# Altium project LimeSDR-USB_1v4.PrjPcb (part 3 of 8)

## Sheet 12_USB3_0_device.SchDoc: USB3.0 device
size A3; Organization: Lime Microsystems; Address1: Surrey Tech Centre; Address2: Guildford GU2 7YG; Address3: Surray; Address4: United Kingdom; Revision: v1.4; SheetNumber: 12; SheetTotal: 15
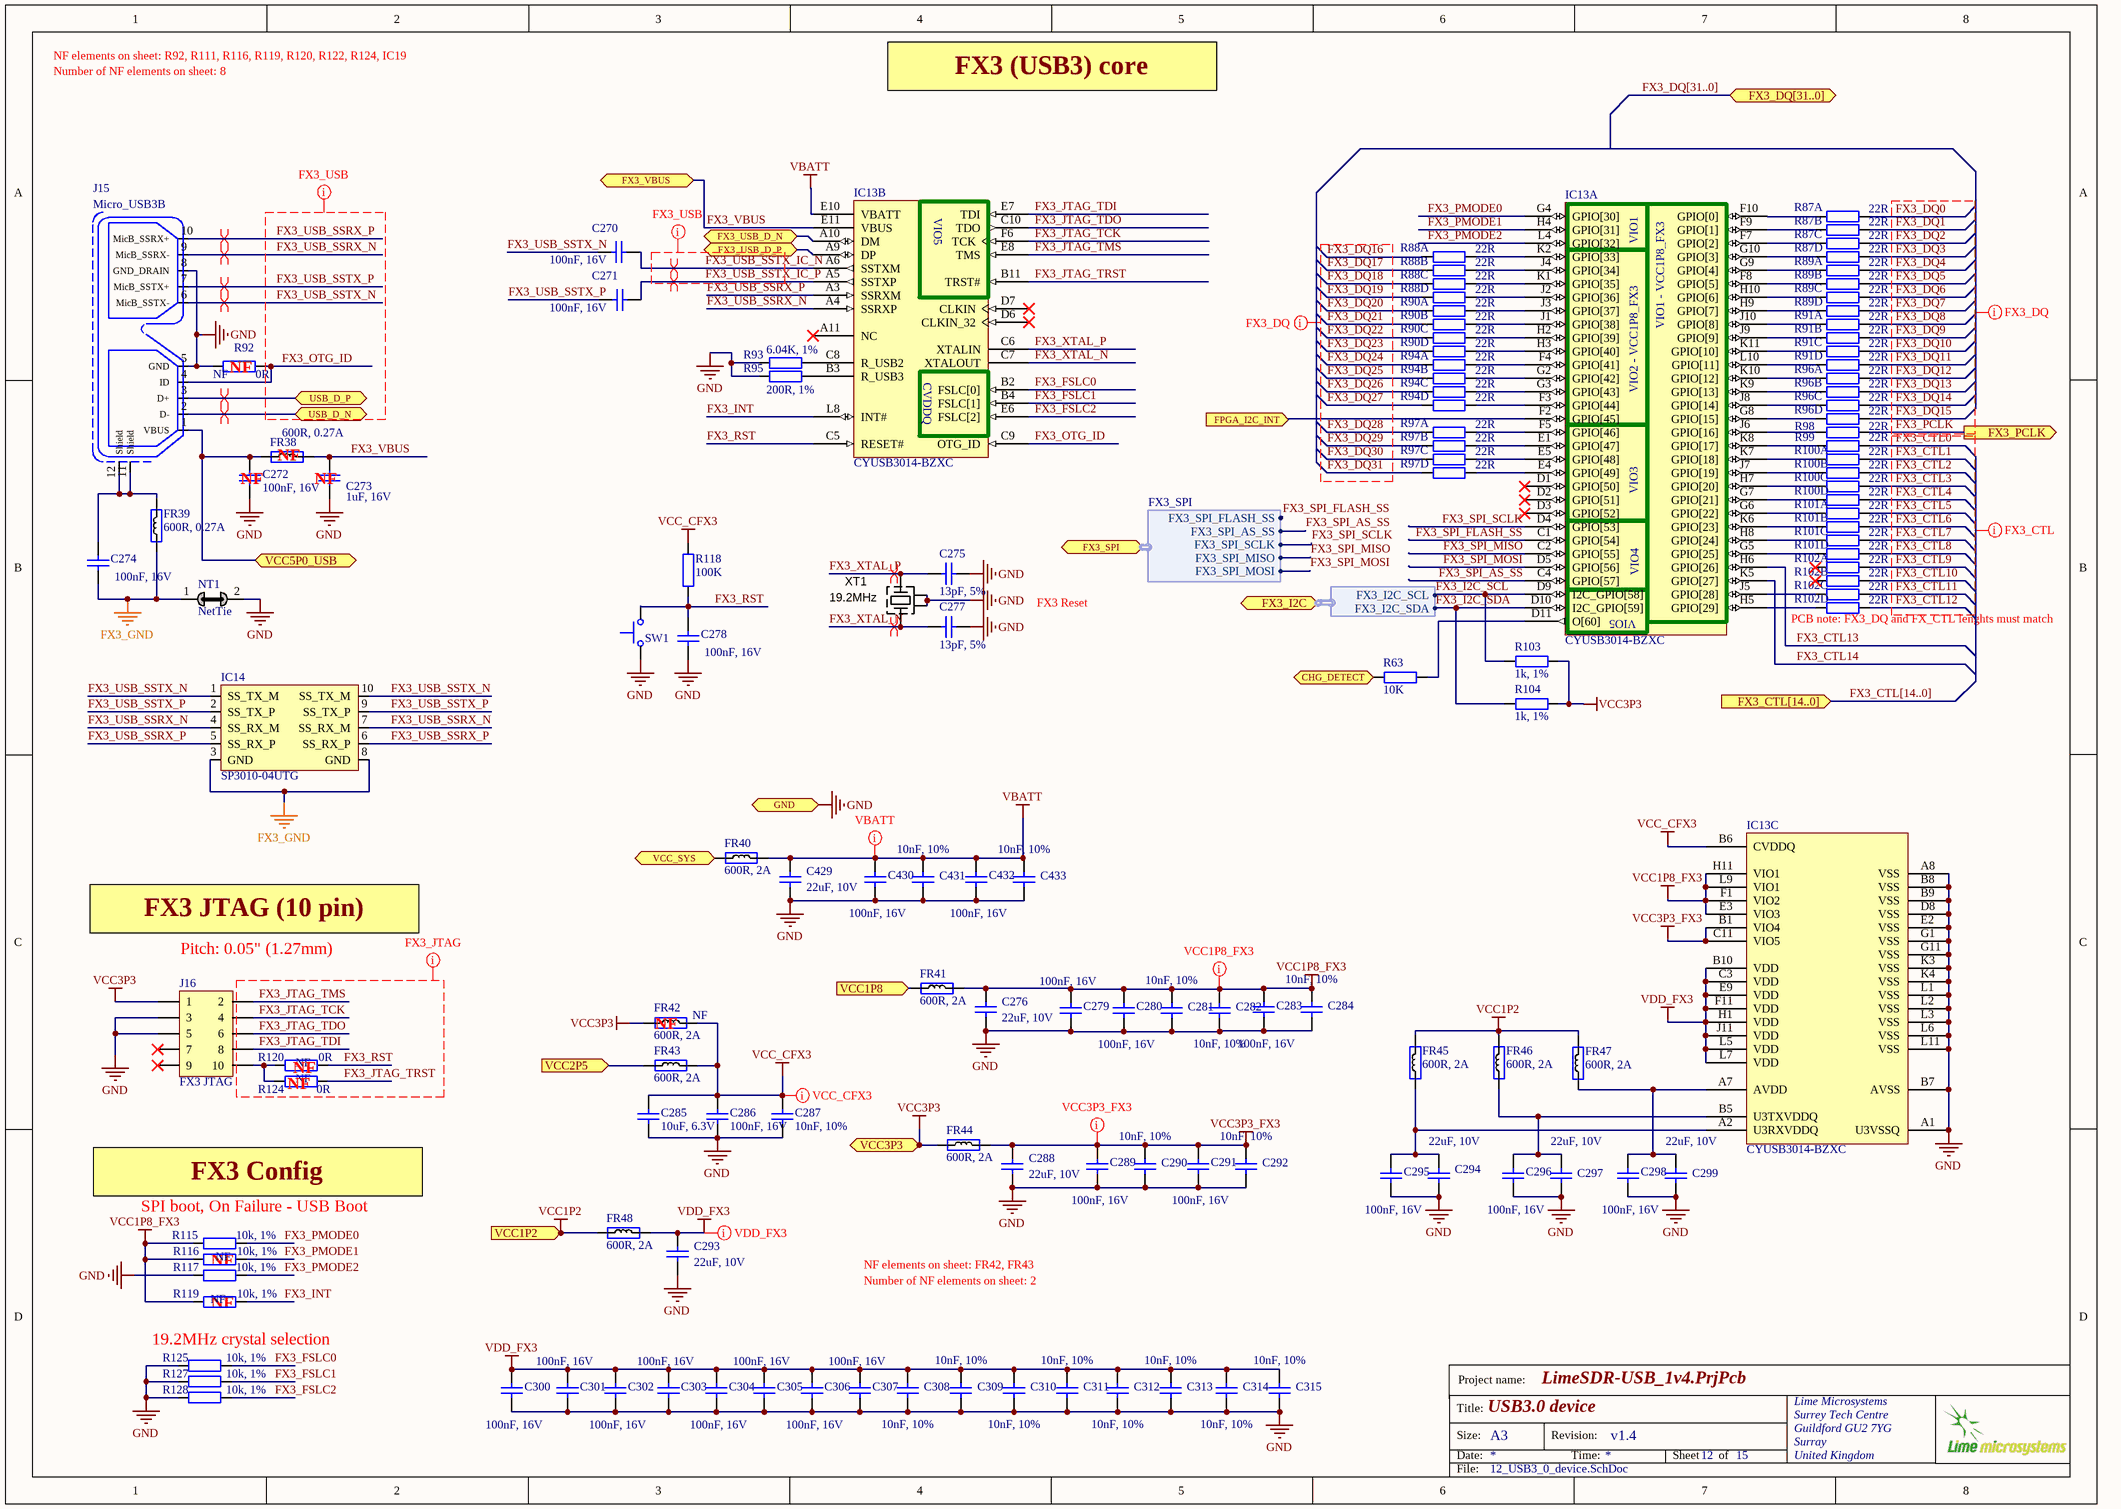
[diagram p4: 12_USB3_0_device.SchDoc]

### Parts
(Parts that share a designator on the sheet are numbered #1, #2 ... from top to bottom, then left to right.)
C270  100nF, 16V  [CAP0402]
C271  100nF, 16V  [CAP0402]
C272  100nF, 16V  [CAP0402]
C273  1uF, 16V  [CAP0603]
C274  100nF, 16V  [CAP0402]
C275  13pF, 5%  [CAP0402]
C276  22uF, 10V  [CAP0603]
C277  13pF, 5%  [CAP0402]
C278  100nF, 16V  [CAP0402]
C279  100nF, 16V  [CAP0402]
C280  100nF, 16V  [CAP0402]
C281  10nF, 10%  [CAP0402]
C282  10nF, 10%  [CAP0402]
C283  100nF, 16V  [CAP0402]
C284  10nF, 10%  [CAP0402]
C285  10uF, 6.3V  [CAP0603]
C286  100nF, 16V  [CAP0402]
C287  10nF, 10%  [CAP0402]
C288  22uF, 10V  [CAP0603]
C289  100nF, 16V  [CAP0402]
C290  10nF, 10%  [CAP0402]
C291  100nF, 16V  [CAP0402]
C292  10nF, 10%  [CAP0402]
C293  22uF, 10V  [CAP0603]
C294  22uF, 10V  [CAP0603]
C295  100nF, 16V  [CAP0402]
C296  100nF, 16V  [CAP0402]
C297  22uF, 10V  [CAP0603]
C298  100nF, 16V  [CAP0402]
C299  22uF, 10V  [CAP0603]
C300  100nF, 16V  [CAP0402]
C301  100nF, 16V  [CAP0402]
C302  100nF, 16V  [CAP0402]
C303  100nF, 16V  [CAP0402]
C304  100nF, 16V  [CAP0402]
C305  100nF, 16V  [CAP0402]
C306  100nF, 16V  [CAP0402]
C307  100nF, 16V  [CAP0402]
C308  10nF, 10%  [CAP0402]
C309  10nF, 10%  [CAP0402]
C310  10nF, 10%  [CAP0402]
C311  10nF, 10%  [CAP0402]
C312  10nF, 10%  [CAP0402]
C313  10nF, 10%  [CAP0402]
C314  10nF, 10%  [CAP0402]
C315  10nF, 10%  [CAP0402]
C429  22uF, 10V  [CAP0603]
C430  100nF, 16V  [CAP0402]
C431  10nF, 10%  [CAP0402]
C432  100nF, 16V  [CAP0402]
C433  10nF, 10%  [CAP0402]
FR38  600R, 0.27A  [RES0201]
FR39  600R, 0.27A  [RES0201]
FR40  600R, 2A  [RES0805]
FR41  600R, 2A  [RES0805]
FR42  600R, 2A  Assembly Info: NF  [RES0805]
FR43  600R, 2A  [RES0805]
FR44  600R, 2A  [RES0805]
FR45  600R, 2A  [RES0805]
FR46  600R, 2A  [RES0805]
FR47  600R, 2A  [RES0805]
FR48  600R, 2A  [RES0805]
IC13  CYUSB3014-BZXC  [CYP-BZX121]  (parts A,B,C of 3)
IC14  SP3010-04UTG  [SP3010-04UTG]
J15  Micro_USB3B  [microUSB3B_SM_v2]
J16  FX3 JTAG  [SWD_10_pin]
NT1  NetTie  [NetTie_Wide2]  (net tie, no BOM)
R63#1  10K  [RES0402]
R87  22R  [ChipResistorArray]  (parts A,B,C,D of 4)
R88  22R  [ChipResistorArray]  (parts A,B,C,D of 4)
R89  22R  [ChipResistorArray]  (parts A,B,C,D of 4)
R90  22R  [ChipResistorArray]  (parts A,B,C,D of 4)
R91  22R  [ChipResistorArray]  (parts A,B,C,D of 4)
R92  0R  Assembly Info: NF  [RES0402]
R93  6.04K, 1%  [RES0402]
R94  22R  [ChipResistorArray]  (parts A,B,C,D of 4)
R95  200R, 1%  [RES0402]
R96  22R  [ChipResistorArray]  (parts A,B,C,D of 4)
R97  22R  [ChipResistorArray]  (parts A,B,C,D of 4)
R98  22R  [RES0402]
R99  22R  [RES0402]
R100  22R  [ChipResistorArray]  (parts A,B,C,D of 4)
R101  22R  [ChipResistorArray]  (parts A,B,C,D of 4)
R102  22R  [ChipResistorArray]  (parts A,B,C,D of 4)
R103  1k, 1%  [RES0402]
R104  1k, 1%  [RES0402]
R115  10k, 1%  [RES0402]
R116  10k, 1%  Assembly Info: NF  [RES0402]
R117  10k, 1%  [RES0402]
R118  100K  [RES0402]
R119  10k, 1%  Assembly Info: NF  [RES0402]
R120  0R  Assembly Info: NF  [RES0402]
R124  0R  Assembly Info: NF  [RES0402]
R125  10k, 1%  [RES0402]
R127  10k, 1%  [RES0402]
R128  10k, 1%  [RES0402]
SW1  Switch, tactile  [SW_tactile]  (value not drawn)
XT1  19.2MHz  [CRYSTAL_4-LCC_v2]

### Ports
CHG_DETECT (out), FPGA_I2C_INT (in), FX3_CTL[14..0] (in), FX3_DQ[31..0] (bidir), FX3_I2C (harness FX3_I2C), FX3_PCLK (out), FX3_SPI (harness FX3_SPI), FX3_USB_D_N (bidir), FX3_USB_D_P (bidir), FX3_VBUS, GND, USB_D_N (bidir), USB_D_P (bidir), VCC1P2 (in), VCC1P8 (in), VCC2P5 (in), VCC3P3 (in), VCC5P0_USB, VCC_SYS

### Harnesses
FX3_I2C: FX3_I2C_SCL, FX3_I2C_SDA
FX3_SPI: FX3_SPI_SCLK, FX3_SPI_FLASH_SS, FX3_SPI_MISO, FX3_SPI_MOSI, FX3_SPI_AS_SS

### Nets
FX3_GND: C274.2 FR39.1 IC14.3(GND) IC14.8(GND) NT1.1
GND: C272.2 C273.1 C275.1 C276.1 C277.1 C278.2 C279.2 C280.2 C281.1 C282.1 C283.2 C284.1 C285.1 C286.2 C287.1 C288.1 C289.2 C290.1 C291.2 C292.1 C293.1 C294.1 C295.2 C296.2 C297.1 C298.2 C299.1 C300.2 C301.2 C302.2 C303.2 C304.2 C305.2 C306.2 C307.2 C308.1 C309.1 C310.1 C311.1 C312.1 C313.1 C314.1 C315.1 C429.1 C430.2 C431.1 C432.2 C433.1 IC13.A1(U3VSSQ) IC13.A8(VSS) IC13.B7(AVSS) IC13.B8(VSS) IC13.B9(VSS) IC13.D8(VSS) IC13.E2(VSS) IC13.G1(VSS) IC13.G11(VSS) IC13.K3(VSS) IC13.K4(VSS) IC13.L1(VSS) IC13.L2(VSS) IC13.L3(VSS) IC13.L6(VSS) IC13.L11(VSS) J15.5(GND) J15.8(GND_DRAIN) J16.3 J16.5 NT1.2 R92.1 R93.1 R95.1 R117.1 R125.1 R127.1 R128.1 SW1.1 XT1.2(GND) XT1.4(GND) ; port GND
VBATT: C429.2 C430.1 C431.2 C432.1 C433.2 FR40.2 IC13.E10(VBATT)
VCC1P2: FR45.2 FR46.2 FR47.2 FR48.1 ; port VCC1P2  [project net VCC_P0]
VCC1P8_FX3: C276.2 C279.1 C280.1 C281.2 C282.2 C283.1 C284.2 FR41.2 IC13.E3(VIO3) IC13.F1(VIO2) IC13.H11(VIO1) IC13.L9(VIO1) R115.1 R116.1 R119.1
VCC3P3: FR42.2 FR44.1 J16.1 R103.1 R104.1 ; port VCC3P3  [project net VCC_P3]
VCC3P3_FX3: C288.2 C289.1 C290.2 C291.1 C292.2 FR44.2 IC13.B1(VIO4) IC13.C11(VIO5)
VCC5P0_USB: C272.1 FR38.1 J15.1(VBUS) ; port VCC5P0_USB
VCC_CFX3: C285.2 C286.1 C287.2 FR42.1 FR43.1 IC13.B6(CVDDQ) R118.2
VCC_P2: FR43.2 ; port VCC2P5
VCC_SYS: FR40.1 ; port VCC_SYS
VDD_FX3: C293.2 C300.1 C301.1 C302.1 C303.1 C304.1 C305.1 C306.1 C307.1 C308.2 C309.2 C310.2 C311.2 C312.2 C313.2 C314.2 C315.2 FR48.2 IC13.B10(VDD) IC13.C3(VDD) IC13.E9(VDD) IC13.F11(VDD) IC13.H1(VDD) IC13.J11(VDD) IC13.L5(VDD) IC13.L7(VDD)
BQ_nCE: R63#1.1 ; port CHG_DETECT
FX3_CTL0: R99.2
FX3_CTL1: R100.2
FX3_CTL2: R100.4
FX3_CTL3: R100.6
FX3_CTL4: R100.8
FX3_CTL5: R101.2
FX3_CTL6: R101.4
FX3_CTL7: R101.6
FX3_CTL8: R101.8
FX3_CTL9: R102.2
FX3_CTL10: R102.4
FX3_CTL11: R102.6
FX3_CTL12: R102.8
FX3_CTL13: IC13.H6(GPIO[26])
FX3_CTL14: IC13.K5(GPIO[27])
FX3_DQ0: R87.2
FX3_DQ1: R87.4
FX3_DQ2: R87.6
FX3_DQ3: R87.8
FX3_DQ4: R89.2
FX3_DQ5: R89.4
FX3_DQ6: R89.6
FX3_DQ7: R89.8
FX3_DQ8: R91.2
FX3_DQ9: R91.4
FX3_DQ10: R91.6
FX3_DQ11: R91.8
FX3_DQ12: R96.2
FX3_DQ13: R96.4
FX3_DQ14: R96.6
FX3_DQ15: R96.8
FX3_DQ16: R88.1
FX3_DQ17: R88.3
FX3_DQ18: R88.5
FX3_DQ19: R88.7
FX3_DQ20: R90.1
FX3_DQ21: R90.3
FX3_DQ22: R90.5
FX3_DQ23: R90.7
FX3_DQ24: R94.1
FX3_DQ25: R94.3
FX3_DQ26: R94.5
FX3_DQ27: R94.7
FX3_DQ28: R97.1
FX3_DQ29: R97.3
FX3_DQ30: R97.5
FX3_DQ31: R97.7
FX3_FSLC0: IC13.B2(FSLC[0]) R125.2
FX3_FSLC1: IC13.B4(FSLC[1]) R127.2
FX3_FSLC2: IC13.E6(FSLC[2]) R128.2
FX3_I2C_SCL: IC13.D9(I2C_GPIO[58]) R103.2 ; port FX3_I2C.FX3_I2C_SCL
FX3_I2C_SDA: IC13.D10(I2C_GPIO[59]) R104.2 ; port FX3_I2C.FX3_I2C_SDA
FX3_INT: IC13.L8(INT#) R119.2
FX3_JTAG_TCK: IC13.F6(TCK) J16.4
FX3_JTAG_TDI: IC13.E7(TDI) J16.8
FX3_JTAG_TDO: IC13.C10(TDO) J16.6
FX3_JTAG_TMS: IC13.E8(TMS) J16.2
FX3_JTAG_TRST: IC13.B11(TRST#) R124.1
FX3_OTG_ID: IC13.C9(OTG_ID) J15.4(ID) R92.2
FX3_PCLK: R98.1 ; port FX3_PCLK
FX3_PMODE0: IC13.G4(GPIO[30]) R115.2
FX3_PMODE1: IC13.H4(GPIO[31]) R116.2
FX3_PMODE2: IC13.L4(GPIO[32]) R117.2
FX3_RST: C278.1 IC13.C5(RESET#) R118.1 R120.2 SW1.2
FX3_SPI_AS_SS: IC13.C4(GPIO[57]) ; port FX3_SPI.FX3_SPI_AS_SS  [project net FX3_SPI.FX3_SPI_AS_SS]
FX3_SPI_FLASH_SS: IC13.C1(GPIO[54]) ; port FX3_SPI.FX3_SPI_FLASH_SS  [project net FX3_SPI.FX3_SPI_FLASH_SS]
FX3_SPI_MISO: IC13.C2(GPIO[55]) ; port FX3_SPI.FX3_SPI_MISO  [project net FX3_SPI.FX3_SPI_MISO]
FX3_SPI_MOSI: IC13.D5(GPIO[56]) ; port FX3_SPI.FX3_SPI_MOSI  [project net FX3_SPI.FX3_SPI_MOSI]
FX3_SPI_SCLK: IC13.D4(GPIO[53]) ; port FX3_SPI.FX3_SPI_SCLK  [project net FX3_SPI.FX3_SPI_SCLK]
FX3_USB_D_N: IC13.A10(DM) ; port FX3_USB_D_N
FX3_USB_D_P: IC13.A9(DP) ; port FX3_USB_D_P
FX3_USB_SSRX_N: IC13.A4(SSRXP) IC14.4(SS_RX_M) IC14.7(SS_RX_M) J15.9(MicB_SSRX-)
FX3_USB_SSRX_P: IC13.A3(SSRXM) IC14.5(SS_RX_P) IC14.6(SS_RX_P) J15.10(MicB_SSRX+)
FX3_USB_SSTX_IC_N: C270.2 IC13.A6(SSTXM)
FX3_USB_SSTX_IC_P: C271.1 IC13.A5(SSTXP)
FX3_USB_SSTX_N: C270.1 IC14.1(SS_TX_M) IC14.10(SS_TX_M) J15.6(MicB_SSTX-)
FX3_USB_SSTX_P: C271.2 IC14.2(SS_TX_P) IC14.9(SS_TX_P) J15.7(MicB_SSTX+)
FX3_VBUS: C273.2 FR38.2 IC13.E11(VBUS) ; port FX3_VBUS
FX3_XTAL_N: C277.2 IC13.C7(XTALOUT) XT1.3(X)
FX3_XTAL_P: C275.2 IC13.C6(XTALIN) XT1.1(X)
USB_D_N: J15.2(D-) ; port USB_D_N
USB_D_P: J15.3(D+) ; port USB_D_P
VCC1P8: FR41.1 ; port VCC1P8
NetC274_1: C274.1 FR39.2 J15.11(Shield) J15.12(Shield)
NetC294_2: C294.2 C295.1 FR45.1 IC13.A2(U3RXVDDQ)
NetC296_1: C296.1 C297.2 FR46.1 IC13.B5(U3TXVDDQ)
NetC298_1: C298.1 C299.2 FR47.1 IC13.A7(AVDD)
NetIC8_R1: IC13.F2(GPIO[45]) ; port FPGA_I2C_INT
NetIC13_B3: IC13.B3(R_USB3) R95.2
NetIC13_C8: IC13.C8(R_USB2) R93.2
NetIC13_D11: IC13.D11(O[60]) R63#1.2
NetIC13_E1: IC13.E1(GPIO[47]) R97.4
NetIC13_E4: IC13.E4(GPIO[49]) R97.8
NetIC13_E5: IC13.E5(GPIO[48]) R97.6
NetIC13_F3: IC13.F3(GPIO[44]) R94.8
NetIC13_F4: IC13.F4(GPIO[41]) R94.2
NetIC13_F5: IC13.F5(GPIO[46]) R97.2
NetIC13_F7: IC13.F7(GPIO[2]) R87.5
NetIC13_F8: IC13.F8(GPIO[5]) R89.3
NetIC13_F9: IC13.F9(GPIO[1]) R87.3
NetIC13_F10: IC13.F10(GPIO[0]) R87.1
NetIC13_G2: IC13.G2(GPIO[42]) R94.4
NetIC13_G3: IC13.G3(GPIO[43]) R94.6
NetIC13_G5: IC13.G5(GPIO[25]) R101.7
NetIC13_G6: IC13.G6(GPIO[22]) R101.1
NetIC13_G7: IC13.G7(GPIO[21]) R100.7
NetIC13_G8: IC13.G8(GPIO[15]) R96.7
NetIC13_G9: IC13.G9(GPIO[4]) R89.1
NetIC13_G10: IC13.G10(GPIO[3]) R87.7
NetIC13_H2: IC13.H2(GPIO[39]) R90.6
NetIC13_H3: IC13.H3(GPIO[40]) R90.8
NetIC13_H5: IC13.H5(GPIO[29]) R102.7
NetIC13_H7: IC13.H7(GPIO[20]) R100.5
NetIC13_H8: IC13.H8(GPIO[24]) R101.5
NetIC13_H9: IC13.H9(GPIO[7]) R89.7
NetIC13_H10: IC13.H10(GPIO[6]) R89.5
NetIC13_J1: IC13.J1(GPIO[38]) R90.4
NetIC13_J2: IC13.J2(GPIO[36]) R88.8
NetIC13_J3: IC13.J3(GPIO[37]) R90.2
NetIC13_J4: IC13.J4(GPIO[34]) R88.4
NetIC13_J5: IC13.J5(GPIO[28]) R102.5
NetIC13_J6: IC13.J6(GPIO[16]) R98.2
NetIC13_J7: IC13.J7(GPIO[19]) R100.3
NetIC13_J8: IC13.J8(GPIO[14]) R96.5
NetIC13_J9: IC13.J9(GPIO[9]) R91.3
NetIC13_J10: IC13.J10(GPIO[8]) R91.1
NetIC13_K1: IC13.K1(GPIO[35]) R88.6
NetIC13_K2: IC13.K2(GPIO[33]) R88.2
NetIC13_K6: IC13.K6(GPIO[23]) R101.3
NetIC13_K7: IC13.K7(GPIO[18]) R100.1
NetIC13_K8: IC13.K8(GPIO[17]) R99.1
NetIC13_K9: IC13.K9(GPIO[13]) R96.3
NetIC13_K10: IC13.K10(GPIO[12]) R96.1
NetIC13_K11: IC13.K11(GPIO[10]) R91.5
NetIC13_L10: IC13.L10(GPIO[11]) R91.7
NetJ16_10: J16.10 R120.1 R124.2

Not connected (* = marked no-connect by the designer): IC13 A11(NC)* D1(GPIO[50])* D2(GPIO[51])* D3(GPIO[52])* D6(CLKIN_32)* D7(CLKIN)*; J16 7* 9*; R102 1* 3*

### Buses and harness runs
bus FX3_CTL[14..0] = port FX3_CTL[14..0]
bus FX3_DQ[31..0] = port FX3_DQ[31..0]

### Layout directives
differential pair: FX3_USB_SSRX_N, FX3_USB_SSRX_P, FX3_USB_SSTX_IC_N, FX3_USB_SSTX_IC_P, FX3_USB_SSTX_N, FX3_USB_SSTX_P, FX3_XTAL_N, FX3_XTAL_P, USB_D_N, USB_D_P
net class FX3_DATA: FX3_OTG_ID, FX3_USB_SSRX_N, FX3_USB_SSRX_P, FX3_USB_SSTX_IC_N, FX3_USB_SSTX_IC_P, FX3_USB_SSTX_N, FX3_USB_SSTX_P
net class FX3_CTL: FX3_CTL0, FX3_CTL1, FX3_CTL2, FX3_CTL3, FX3_CTL4, FX3_CTL5, FX3_CTL6, FX3_CTL7, FX3_CTL8, FX3_CTL9, FX3_CTL10, FX3_CTL11, FX3_CTL12
net class FX3_DQ: FX3_DQ0, FX3_DQ1, FX3_DQ2, FX3_DQ3, FX3_DQ4, FX3_DQ5, FX3_DQ6, FX3_DQ7, FX3_DQ8, FX3_DQ9, FX3_DQ10, FX3_DQ11, FX3_DQ12, FX3_DQ13, FX3_DQ14, FX3_DQ15, FX3_DQ16, FX3_DQ17, FX3_DQ18, FX3_DQ19, FX3_DQ20, FX3_DQ21, FX3_DQ22, FX3_DQ23, FX3_DQ24, FX3_DQ25, FX3_DQ26, FX3_DQ27, FX3_DQ28, FX3_DQ29, FX3_DQ30, FX3_DQ31, FX3_PCLK
net class FX3_JTAG: FX3_JTAG_TCK, FX3_JTAG_TDI, FX3_JTAG_TDO, FX3_JTAG_TMS, FX3_JTAG_TRST, FX3_RST
net class VCC1P8_FX3: VCC1P8_FX3
net class VCC3P3_FX3: VCC3P3_FX3
net class VCC_CFX3: VCC_CFX3
net class VDD_FX3: VDD_FX3
net class VBATT: VBATT

### Notes on the sheet
- NF elements on sheet: R92, R111, R116, R119, R120, R122, R124, IC19
- Number of NF elements on sheet: 8
- FX3 (USB3) core
- (near IC13) VIO5
- (near IC13) VIO1
- (near R92) NF
- (near IC13) CVDDQ
- (near IC13) VIO1 - VCC1P8_FX3
- (near IC13) VIO2 - VCC1P8_FX3
- (near C272) NF
- (near FR38) NF
- (near C273) NF
- (near IC13) VIO3
- (near IC13) VIO4
- FX3 Reset
- (near R102) PCB note: FX3_DQ and FX_CTL lenghts must match
- FX3 JTAG (10 pin)
- (near J16) Pitch: 0.05" (1.27mm)
- (near FR42) NF
- (near R124) NF
- NF
- FX3 Config
- SPI boot, On Failure - USB Boot
- (near R119) NF
- (near R116) NF
- Number of NF elements on sheet: 2
- NF elements on sheet: FR42, FR43
- (near R125) 19.2MHz crystal selection
- Project name:
- Title:
- Size:
- Date:
- A3
- Revision:
- Time:
- Sheet
- of
- File:

### Library data of the parts
C270 C271 C274 C278-C280 C283 C286 C289 C291 C295 C296 C298 C300-C307 C430 C432 = Cap_0603: Manufacturer Part Number 1: GRM155R71C104KA88D; Part Description: 0.10µF ±10% 16V X7R Ceramic Capacitor -55°C ~ 125°C Surface Mount, MLCC 0402 (1005 Metric) 0.039" L x 0.020" W (1.00mm x 0.50mm); Brand: Murata Electronics; Tolerance: 10 %; Type: General Purpose MLCC; Capacitance: 0.1 uF; Temperature Coefficient / Code: +/- 15 %; Supplier 1: Mouser; Supplier Part Number 1: 81-GRM155R71C104KA88; Case Code - in: 0402; Manufacturer: Murata Electronics; Category: Multilayer Ceramic Capacitors MLCC - SMD/SMT; Voltage Rating DC: 16 V; Value: 100nF, 16V; Manufacturer Part Number: GRM155R71C104KA88D
C272 = Cap_0402: Manufacturer: Murata Electronics; Manufacturer Part Number: GRM155R71C104KA88D; Part Description: 0.10µF ±10% 16V X7R Ceramic Capacitor -55°C ~ 125°C Surface Mount, MLCC 0402 (1005 Metric) 0.039" L x 0.020" W (1.00mm x 0.50mm); Tolerance: 10 %; Type: General Purpose MLCC; Capacitance: 0.1 uF; Case Length: 1 mm; Dielectric: X7R; Case Height: 0.5 mm; Temperature Coefficient / Code: +/- 15 %; Value: 100nF, 16V; Supplier 1: Mouser; Supplier Part Number 1: 81-GRM155R71C104KA88; Case Code - in: 0402; RoHS: RoHS Compliant; Operating Temperature Range: - 55 C to + 125 C; Series: GRM; Termination Style: SMD/SMT; Package / Case: 0402 (1005 metric); Voltage Rating DC: 16 V; Maximum Operating Temperature: + 125 C; Case Code - mm: 1005; Minimum Operating Temperature: - 55 C; Product Category: Low & Medium Capacitance SMD Ceramic Chip Capacitors; Packaging: Reel; Product: General Type MLCCs; Category: Multilayer Ceramic Capacitors MLCC - SMD/SMT; Brand: Murata Electronics; Case Width: 0.5 mm; RoHS - Mouser: Y; Standard Pack Qty: 10000; Minimum Order Quantity: 1; Reeling: True; Manufacturer Part Number 1: GRM155R71C104KA88D
C273 = Cap_0603: Part Description: 1µF ±10% 16V X7R Ceramic Capacitor -55°C ~ 125°C Surface Mount, MLCC 0603 (1608 Metric) 0.063" L x 0.031" W (1.60mm x 0.80mm); Manufacturer Part Number 1: EMK107B7105KA-T; Manufacturer: Taiyo Yuden; Temperature Coefficient: X7R; Capacitance: 1µF; Tolerance: ±10%; Value: 1uF, 16V; Supplier 1: Digi-Key; Supplier Part Number 1: 587-1241-6-ND; Package / Case: 0603 (1608 Metric); Mounting Type: Surface Mount, MLCC; Lead Style: -; Features: -; Voltage - Rated: 16V; Size / Dimension: 0.063" L x 0.031" W (1.60mm x 0.80mm); Height - Seated (Max): -; Packaging: Digi-Reel®; Thickness (Max): 0.035" (0.90mm); Lead Spacing: -; Ratings: -; RoHS: RoHS Compliant; Operating Temperature: -55°C ~ 125°C; Category: Capacitors; Applications: General Purpose
C275 C277 = Cap_0603: Manufacturer: Murata Electronics North America; Part Description: 13pF ±5% 50V C0G, NP0 Ceramic Capacitor -55°C ~ 125°C Surface Mount, MLCC 0402 (1005 Metric) 0.039" L x 0.020" W (1.00mm x 0.50mm); Voltage - Rated: 50V; Supplier 1: Digi-Key; Supplier Part Number 1: 490-5925-2-ND; Tolerance: ±5%; Capacitance: 13pF; Category: Capacitors; Package / Case: 0402 (1005 Metric); Value: 13pF, 5%
C276 C288 C293 C294 C297 C299 C429 = Cap_0603: Manufacturer Part Number 1: C1608X5R1A226M080AC; Part Description: 22µF ±20% 10V X5R Ceramic Capacitor -55°C ~ 85°C Surface Mount, MLCC 0603 (1608 Metric) 0.063" L x 0.031" W (1.60mm x 0.80mm); Brand: TDK; Temperature Coefficient / Code: +/- 15 %; Tolerance: 20 %; Type: Multilayer Ceramic Chip Capacitor; Supplier 1: Mouser; Supplier Part Number 1: 810-C1608X5R1A226M; Package / Case: 0603 (1608 metric); Category: Multilayer Ceramic Capacitors MLCC - SMD/SMT; Capacitance: 22 uF; Operating Temperature Range: - 55 C to + 85 C; Case Code - in: 0603; Voltage Rating DC: 10 V; Case Code - mm: 1608; Value: 22uF, 10V; Manufacturer: TDK
C281 C282 C284 C287 C290 C292 C308-C315 C431 C433 = Cap_0603: Part Description: 10000pF ±10% 50V X7R Ceramic Capacitor -55°C ~ 125°C Surface Mount, MLCC 0402 (1005 Metric) 0.039" L x 0.020" W (1.00mm x 0.50mm); Manufacturer: Yageo; Capacitance: 10000pF; Voltage - Rated: 50V; Supplier 1: Digi-Key; Supplier Part Number 1: 311-1349-2-ND; Category: Capacitors; Package / Case: 0402 (1005 Metric); Tolerance: ±10%; Value: 10nF, 10%
C285 = Cap_0603: Manufacturer Part Number 1: CC0603MRX5R5BB106; Part Description: 10µF ±20% 6.3V X5R Ceramic Capacitor -55°C ~ 85°C Surface Mount, MLCC 0603 (1608 Metric) 0.063" L x 0.031" W (1.60mm x 0.80mm); Manufacturer: Yageo; Capacitance: 10µF; Tolerance: ±20%; Supplier 1: Digi-Key; Supplier Part Number 1: 311-1448-2-ND; Package / Case: 0603 (1608 Metric); Category: Capacitors; Voltage - Rated: 6.3V; Value: 10uF, 6.3V
FR38 FR39 = Ferrite: Manufacturer Part Number 1: BK0603TS601-T; Manufacturer: Taiyo Yuden; Part Description: FERRITE BEAD 600 OHM 0201 1LN; DC Resistance (DCR): 750 mOhm Max; Filter Type: Differential Mode - Single; Impedance @ Frequency: 600 Ohm @ 100MHz; Current Rating: 270mA; Supplier 1: Digi-Key; Supplier Part Number 1: 587-3277-1-ND; Size / Dimension: 0.024" L x 0.012" W (0.60mm x 0.30mm); Package / Case: 0201 (0603 Metric); Height (Max): 0.013" (0.33mm); Mounting Type: Surface Mount; Packaging: Cut Tape (CT); RoHS: RoHS Compliant; Category: Filters; Value: 600R, 0.27A
FR40-FR48 = Ferrite: Manufacturer Part Number 1: MPZ2012S601AT000; Manufacturer: TDK Corporation; Part Description: FERRITE BEAD 600 OHM 0805 1LN; DC Resistance (DCR): 100 mOhm Max; Filter Type: Differential Mode - Single; Impedance @ Frequency: 600 Ohm @ 100MHz; Supplier 1: Digi-Key; Supplier Part Number 1: 445-2206-2-ND; Value: 600R, 2A; Category: Filters; Current Rating: 2A; Height (Max): 0.041" (1.05mm); Mounting Type: Surface Mount; Package / Case: 0805 (2012 Metric); Packaging: Tape & Reel (TR); RoHS: RoHS Compliant; Size / Dimension: 0.079" L x 0.049" W (2.00mm x 1.25mm)
IC13 = CYUSB3014-BZXC: EZ-USB(R) FX3: SuperSpeed USB Controller, 512 KB, 60 I/Os, 0 to 70 degC, 121-Pin FBGA (BZX121); Manufacturer: Cypress Semiconductor Corp; CPU Core: ARM926 EJ-S; Max. Operating Voltage (V): 1.25; Memory Architecture: SRAM; Memory Size (KB): 512; Min. Operating Voltage (V): 1.15; No. of I/Os: 60; DatasheetVersion: Rev. *O; PackageVersion: Rev. *D; PackageReference: BZX121; PackageDescription: 121-Ball FBGA, Body 10 x 10 mm, Pitch 0.8 mm; Supplier 1: Digi-Key; Supplier Part Number 1: 428-3182-ND; Supplier 2: Farnell; Supplier Part Number 2: 2355789; Supplier 3: Newark; Supplier Part Number 3: 54W7901; Supplier 4: Mouser; Supplier Part Number 4: 727-CYUSB3014-BZXC; Max. Operating Temp. (degreesC): 70; Min. Operating Temp. (degreesC): 0; RoHS: Pb-Free; Mounting Technology: Surface Mount; Code_JEDEC: PUB 95; PartNumber: CYUSB3014-BZXC; ComponentLink1Description: Manufacturer URL; ComponentLink1URL: http://www.cypress.com/; ComponentLink2Description: Datasheet; ComponentLink2URL: http://www.cypress.com/?docID=49087; ComponentLink3Description: Package Specification; ComponentLink3URL: http://www.cypress.com/?docID=45795; Part Description: EZ-USB(R) FX3: SuperSpeed USB Controller, 512 KB, 60 I/Os, 0 to 70 degC, 121-Pin FBGA (BZX121)
IC14 = SP3010-04UTG: Manufacturer: Littelfuse Inc; Part Description: TVS DIODE 6VWM 12.3VC UDFN; Supplier 1: Digi-Key; Category: Circuit Protection; Supplier Device Package: 10-µDFN (2.5x1.0); Supplier Part Number 1: F3507TR-ND; Manufacturer Part Number 1: SP3010-04UTG
J15 = Micro_USB3_B: Manufacturer: Amphenol Commercial Products; Manufacturer Part Number 1: GSB443T33HR; Part Description: USB - micro B USB 3.1, Superspeed+ Receptacle Connector 10 Position Surface Mount, Right Angle; Connector Type: USB - micro B; Specifications: USB 3.1, Superspeed+; Gender: Receptacle; Number of Contacts: 10; Supplier 1: Digi-Key; Supplier Part Number 1: GSB443T33HRCT-ND; Category: Connectors, Interconnects; Features: Board Guide; Ingress Protection: -; RoHS: RoHS Compliant; Packaging: Cut Tape (CT); Mounting Type: Surface Mount, Right Angle, Horizontal
J16 = Header 5X2_SWD: Header, 5-Pin, Dual row; Manufacturer Part Number 1: M50-3600542; Manufacturer: Harwin Inc; Part Description: CONN HDR 1.27MM SMD AU 10POS; Number of Positions: 10; Molding Height Above Board: 0.039" (1.00mm); Row Spacing: 0.050" (1.27mm); Number of Positions Loaded: All; Connector Type: Unshrouded; Supplier 1: Digi-Key; Contact Mating Length: 0.118" (3.00mm); Category: Connectors, Interconnects; Color: Black; RoHS: RoHS Compliant; Number of Rows: 2; Contact Finish Thickness: 3µin (0.08µm); Height Stacking (Mating): -; Contact Finish: Gold; Termination: Solder; Mounting Type: Surface Mount; Pitch: 0.050" (1.27mm); Features: -; Packaging: Bulk; Supplier Part Number 1: 952-1389-ND
R63#1 = Res_0402: Value: 0R
R87-R91 R94 R96 R97 R100-R102 = ResArray_0802: Part Description: RES ARRAY 4 RES 22 OHM 0804; Manufacturer: Yageo; Manufacturer Part Number 1: YC124-JR-0722RL; Temperature Coefficient: ±200ppm/°C; Tolerance: ±5%; Supplier 1: Digi-Key; Supplier Part Number 1: YC124J-22TR-ND; Package / Case: 0804, Convex, Long Side Terminals; Value: 22R
R92 R120 = Res_0402: Manufacturer: Yageo; Part Description: RES SMD 0.0OHM JUMPER 1/16W 0402; Supplier 1: Digi-Key; Supplier Part Number 1: 311-0.0JRTR-ND; Composition: Thick Film; Package / Case: 0402 (1005 Metric); Category: Resistors; Value: 0R
R93 = Res_0402: Manufacturer: Rohm Semiconductor; Manufacturer Part Number 1: MCR01MRTF6041; Part Description: RES SMD 6.04K OHM 1% 1/16W 0402; Temperature Coefficient: ±100ppm/°C; Supplier Part Number 1: RHM6.04KCDTR-ND; Supplier 1: Digi-Key; Category: Resistors; Supplier Device Package: 0402 (1005 Metric); Composition: Thick Film; Tolerance: ±1%; Value: 6.04K, 1%
R95 = Res_0402: Manufacturer: Stackpole Electronics Inc; Part Description: RES SMD 200 OHM 1% 1/16W 0402; Power (Watts): 0.063W, 1/16W; Resistance (Ohms): 200; Temperature Coefficient: ±100ppm/°C; Supplier 1: Digi-Key; Supplier Device Package: 0402; Composition: Thick Film; Category: Resistors; Tolerance: ±1%; Supplier Part Number 1: RMCF0402FT200RDKR-ND; Value: 200R, 1%
R98 R99 = Res_0402: Part Description: RES SMD 22 OHM 1% 1/16W 0402; Manufacturer Part Number 1: RC0402FR-0722RL; Manufacturer: Yageo; Tolerance: ±1%; Temperature Coefficient: ±100ppm/°C; Resistance (Ohms): 22; Supplier 1: Digi-Key; Supplier Part Number 1: 311-22.0LRTR-ND; Supplier Device Package: 0402; Composition: Thick Film; Category: Resistors; Value: 22R
R103 R104 = Res_0402: Manufacturer: Stackpole Electronics Inc; Manufacturer Part Number 1: RMCF0402FT1K00; Part Description: RES SMD 1K OHM 1% 1/16W 0402; Temperature Coefficient: ±100ppm/°C; Power (Watts): 0.063W, 1/16W; Value: 1k, 1%; Supplier 1: Digi-Key; Supplier Part Number 1: RMCF0402FT1K00TR-ND; Package / Case: 0402 (1005 Metric); Supplier Device Package: 0402; Height: 0.016" (0.40mm); Size / Dimension: 0.039" L x 0.020" W (1.00mm x 0.50mm); Number of Terminations: 2; Packaging: Tape & Reel (TR); Category: Resistors; Composition: Thick Film; Resistance (Ohms): 1k; Tolerance: ±1%; Features: Moisture Resistant; Operating Temperature: -55°C ~ 155°C; RoHS: RoHS Compliant
R115-R117 R119 R125 R127 R128 = Res_0402: Manufacturer: Yageo; Manufacturer Part Number 1: RC0402FR-0710KL; Part Description: RES SMD 10K OHM 1% 1/16W 0402; Temperature Coefficient: ±100ppm/°C; Power (Watts): 0.063W, 1/16W; Value: 10k, 1%; Supplier 1: Digi-Key; Supplier Part Number 1: 311-10.0KLRTR-ND; Resistance (Ohms): 10k; Packaging: Tape & Reel (TR); RoHS: RoHS Compliant; Package / Case: 0402 (1005 Metric); Tolerance: ±1%; Operating Temperature: -55°C ~ 155°C; Size / Dimension: 0.039" L x 0.020" W (1.00mm x 0.50mm); Number of Terminations: 2; Category: Resistors; Height: 0.016" (0.40mm); Supplier Device Package: 0402; Features: Moisture Resistant; Composition: Thick Film
R118 = Res_0402: Manufacturer Part Number 1: ERJ-2GEJ104X; Manufacturer: Panasonic Electronic Components; Part Description: RES SMD 100K OHM 5% 1/10W 0402; Tolerance: ±5%; Temperature Coefficient: ±200ppm/°C; Power (Watts): 0.1W, 1/10W; Value: 100K; Supplier 1: Digi-Key; Supplier Part Number 1: P100KJCT-ND; Resistance (Ohms): 100k; Composition: Thick Film; Features: Automotive AEC-Q200; Number of Terminations: 2; Height: 0.016" (0.40mm); RoHS: RoHS Compliant; Package / Case: 0402 (1005 Metric); Packaging: Cut Tape (CT); Size / Dimension: 0.039" L x 0.020" W (1.00mm x 0.50mm); Supplier Device Package: 0402; Operating Temperature: -55°C ~ 155°C; Category: Resistors
R124 = Res_0402: Manufacturer Part Number 1: RC0402JR-070RL; Manufacturer: Yageo; Part Description: RES SMD 0.0OHM JUMPER 1/16W 0402; Resistance (Ohms): 0.0; Tolerance: Jumper; Power (Watts): 0.063W, 1/16W; Value: 0R; Supplier 1: Digi-Key; Supplier Part Number 1: 311-0.0JRTR-ND; Category: Resistors; Temperature Coefficient: -; Features: Moisture Resistant; Supplier Device Package: 0402; Height: 0.016" (0.40mm); Package / Case: 0402 (1005 Metric); Operating Temperature: -55°C ~ 155°C; Size / Dimension: 0.039" L x 0.020" W (1.00mm x 0.50mm); Composition: Thick Film; Packaging: Tape & Reel (TR); Number of Terminations: 2; RoHS: RoHS Compliant
SW1 = Button: Part Description: SWITCH TACTILE SPST-NO 0.05A 12V; Manufacturer: Omron Electronics Inc-EMC Div; Manufacturer Part Number 1: B3U-1000P; Outline: 3.00mm x 2.50mm; Actuator Type: Standard; Mechanical Life: 200,000 Cycles; Actuator Orientation: Top Actuated; Supplier 1: Digi-Key; Supplier Part Number 1: SW1020TR-ND; Category: Switches
XT1 = CRYSTAL_19M2: Oscillator Crystal 19.2 MHz; Manufacturer Part Number 1: 405C35B19M20000; Manufacturer: CTS-Frequency Controls; Part Description: 19.2MHz ±30ppm Crystal 13pF 60 Ohm -20°C ~ 70°C Surface Mount 4-SMD, No Lead (DFN, LCC); Frequency Tolerance: ±30ppm; ESR (Equivalent Series Resistance): 60 Ohm; Load Capacitance: 13pF; Frequency Stability: ±50ppm; Operating Mode: Fundamental; Supplier 1: Digi-Key; Supplier Part Number 1: CTX648CT-ND; Height: 0.041" (1.05mm); Category: Crystals and Oscillators; Package / Case: 4-SMD, No Lead (DFN, LCC); Mounting Type: Surface Mount; Operating Temperature: -20°C ~ 70°C; Size / Dimension: 0.197" L x 0.126" W (5.00mm x 3.20mm); Frequency: 19.2MHz

## Sheet 13_USB3_0_peripheral.SchDoc: USB3_0 Peripheral
size A3; Author: NeoExiZ; CompanyName: BUPT CPS Lab; Engineer: NeoExiZ; Organization: NeoExiZ; Address1: 418, 4#Building,BUPT; Address2: No.10, Xitucheng Road; Address3: Beijing; Address4: China
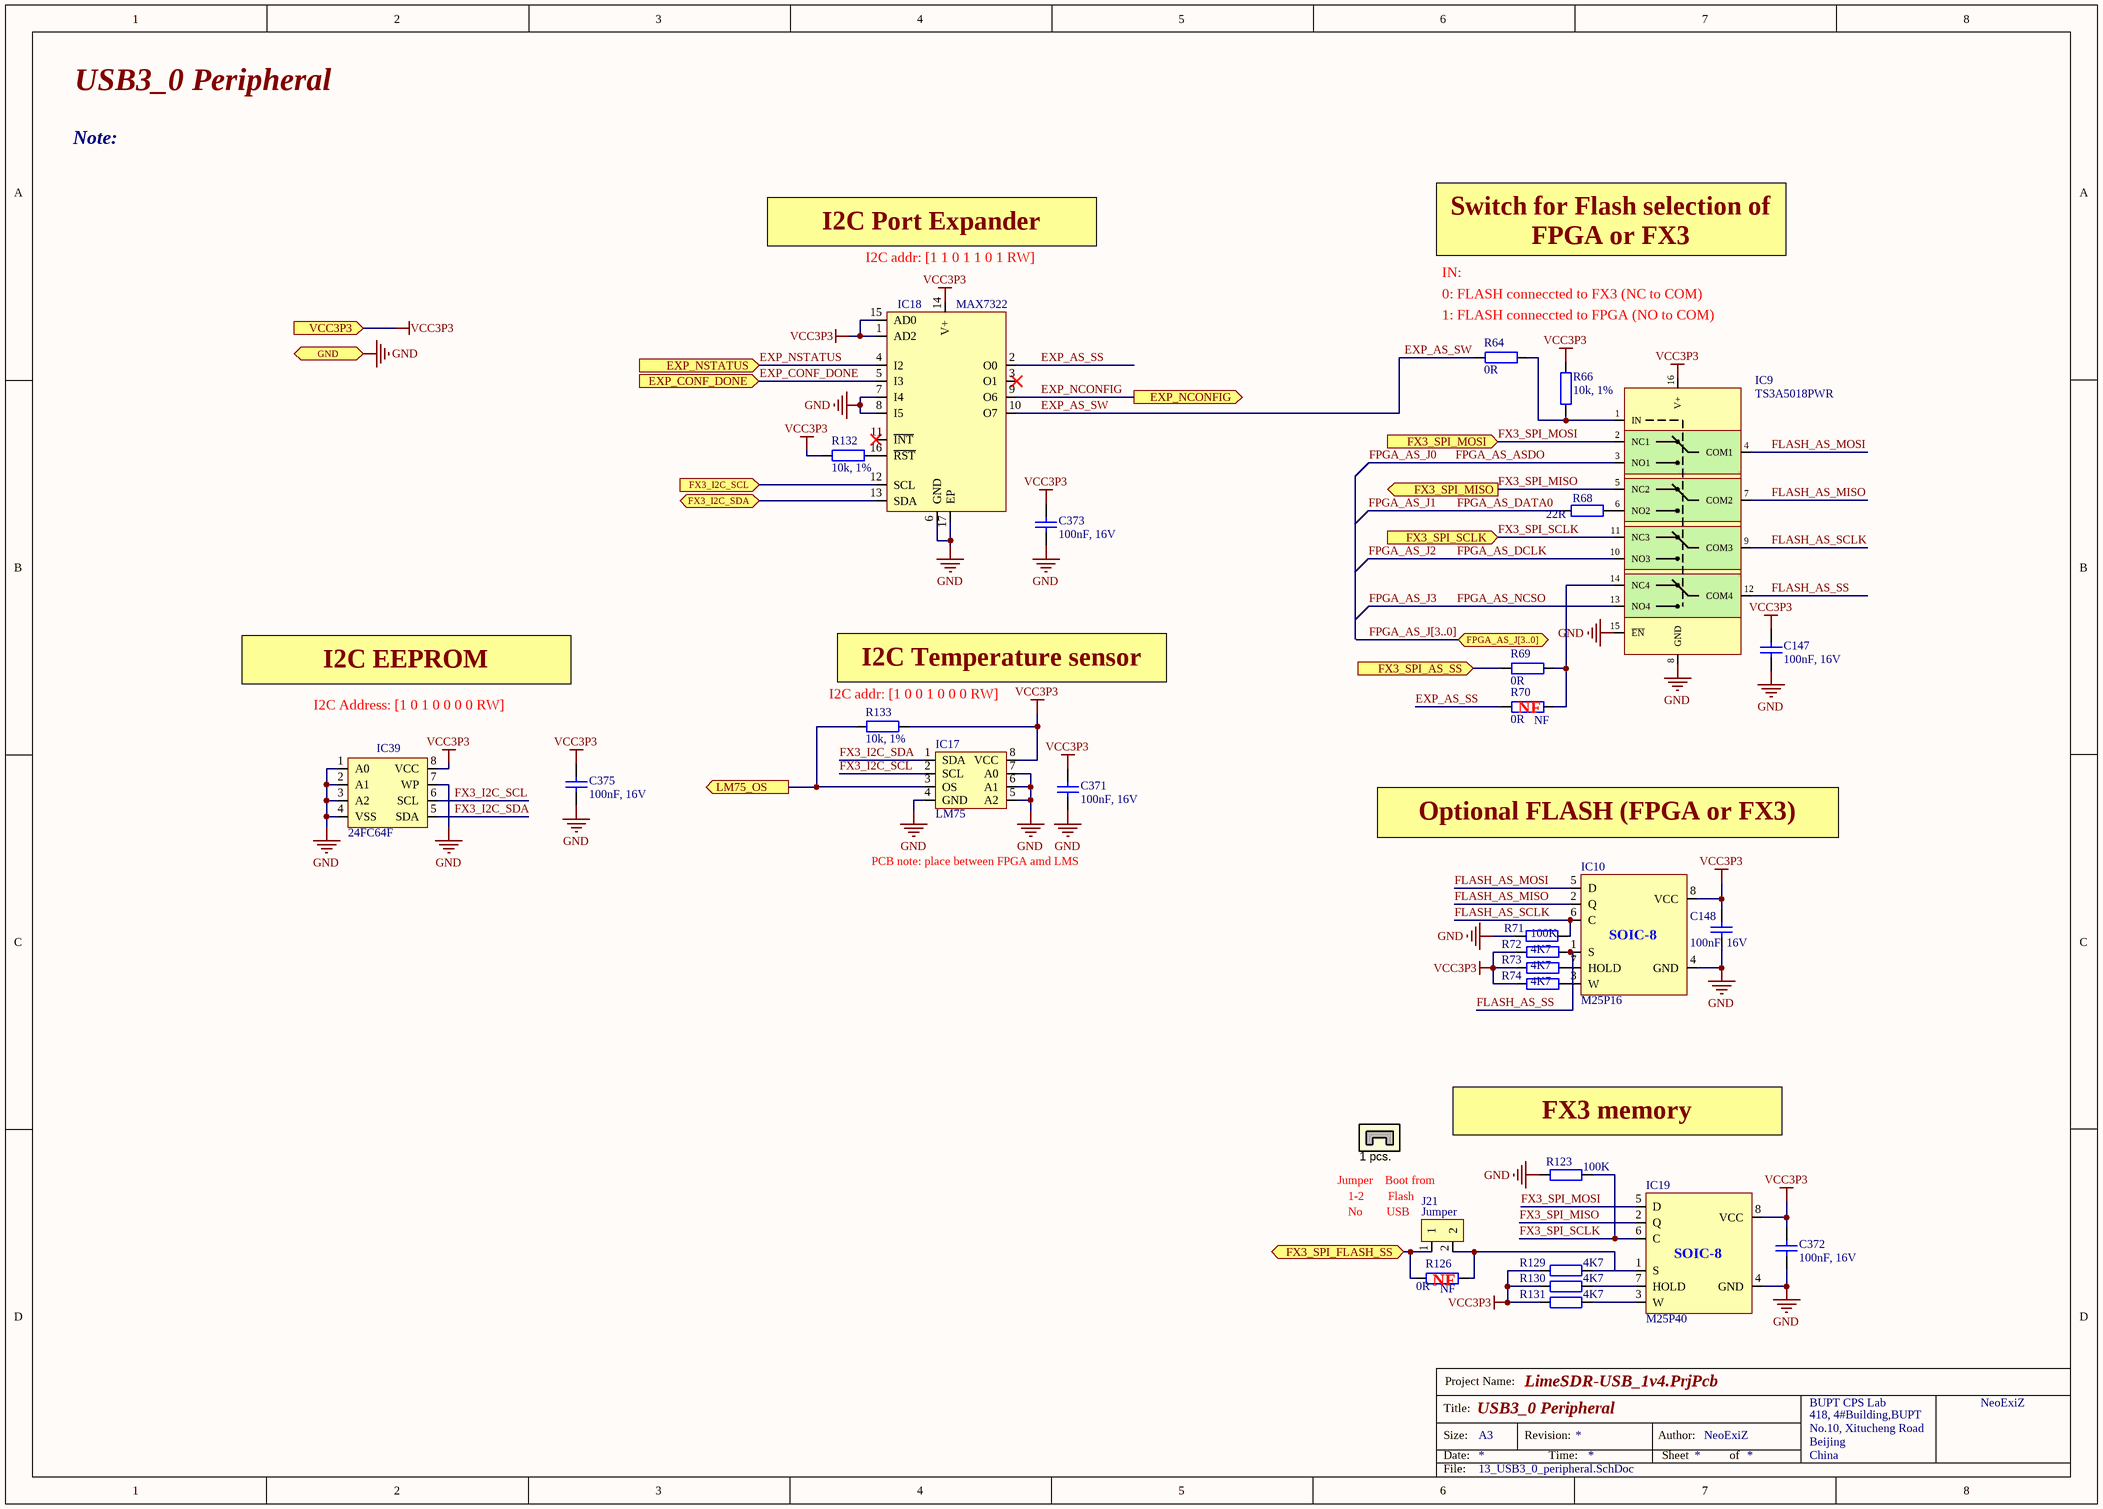
[diagram p5: 13_USB3_0_peripheral.SchDoc]

### Parts
C147  100nF, 16V  [CAP0402]
C148  100nF, 16V  [CAP0402]
C371  100nF, 16V  [CAP0402]
C372  100nF, 16V  [CAP0402]
C373  100nF, 16V  [CAP0402]
C375  100nF, 16V  [CAP0402]
IC9  TS3A5018PWR  [TS3A5018PWR]
IC10  M25P16  [M25P40-VMN6TPB_SO8N]
IC17  LM75  [HWSON8_LM75]
IC18  MAX7322  [MAX7322ATE_QFN16]
IC19  M25P40  [M25P40-VMN6TPB_SO8N]
IC39  24FC64F  [24FC512]
J21  Jumper  [HDR_1x2_HALF_PITCH]
JMP1  1 pcs.  [MECH_JUMPER_HALF_PITCH]
R64  0R  [RES0402]
R66  10k, 1%  [RES0402]
R68  22R  [RES0402]
R69  0R  [RES0402]
R70  0R  Assembly Info: NF  [RES0402]
R71  100K  [RES0402]
R72  4K7  [RES0402]
R73  4K7  [RES0402]
R74  4K7  [RES0402]
R123  100K  [RES0402]
R126  0R  Assembly Info: NF  [RES0402]
R129  4K7  [RES0402]
R130  4K7  [RES0402]
R131  4K7  [RES0402]
R132  10k, 1%  [RES0402]
R133  10k, 1%  [RES0402]

### Ports
EXP_CONF_DONE (in), EXP_NCONFIG (out), EXP_NSTATUS (in), FPGA_AS_J[3..0], FX3_I2C_SCL (in), FX3_I2C_SDA (bidir), FX3_SPI_AS_SS (in), FX3_SPI_FLASH_SS (bidir), FX3_SPI_MISO (out), FX3_SPI_MOSI (in), FX3_SPI_SCLK (in), GND, LM75_OS (out), VCC3P3 (in)

### Nets
GND: C147.2 C148.2 C371.2 C372.2 C373.2 C375.2 IC9.8(GND) IC9.15(~{EN}) IC10.4(GND) IC17.4(GND) IC17.5(A2) IC17.6(A1) IC17.7(A0) IC18.6(GND) IC18.7(I4) IC18.8(I5) IC18.17(EP) IC19.4(GND) IC39.1(A0) IC39.2(A1) IC39.3(A2) IC39.4(VSS) IC39.7(WP) R71.2 R123.1 ; port GND
VCC3P3: C147.1 C148.1 C371.1 C372.1 C373.1 C375.1 IC9.16(V+) IC10.8(VCC) IC17.8(VCC) IC18.1(AD2) IC18.14(V+) IC18.15(AD0) IC19.8(VCC) IC39.8(VCC) R66.1 R72.1 R73.1 R74.1 R129.1 R130.1 R131.1 R132.1 R133.2 ; port VCC3P3  [project net VCC_P3]
EXP_AS_SS: IC18.2(O0) R70.2
EXP_AS_SW: IC18.10(O7) R64.2
EXP_CONF_DONE: IC18.5(I3) ; port EXP_CONF_DONE
EXP_NCONFIG: IC18.9(O6) ; port EXP_NCONFIG
EXP_NSTATUS: IC18.4(I2) ; port EXP_NSTATUS
FLASH_AS_MISO: IC9.7(COM2) IC10.2(Q)
FLASH_AS_MOSI: IC9.4(COM1) IC10.5(D)
FLASH_AS_SCLK: IC9.9(COM3) IC10.6(C) R71.1
FLASH_AS_SS: IC9.12(COM4) IC10.1(S) R72.2
FPGA_AS_ASDO: IC9.3(NO1)  [also labelled FPGA_AS_J0]
FPGA_AS_DATA0: R68.2  [also labelled FPGA_AS_J1]
FPGA_AS_DCLK: IC9.10(NO3)  [also labelled FPGA_AS_J2]
FPGA_AS_J3: IC9.13(NO4)  [also labelled FPGA_AS_NCSO]
FX3_I2C_SCL: IC17.2(SCL) IC39.6(SCL)
FX3_I2C_SDA: IC17.1(SDA) IC39.5(SDA)
FX3_SPI_MISO: IC9.5(NC2) IC19.2(Q) ; port FX3_SPI_MISO
FX3_SPI_MOSI: IC9.2(NC1) IC19.5(D) ; port FX3_SPI_MOSI
FX3_SPI_SCLK: IC9.11(NC3) IC19.6(C) R123.2 ; port FX3_SPI_SCLK
LM75_OS: IC17.3(OS) R133.1 ; port LM75_OS
NetIC9_1: IC9.1(IN) R64.1 R66.2
NetIC9_6: IC9.6(NO2) R68.1
NetIC9_14: IC9.14(NC4) R69.1 R70.1
NetIC10_3: IC10.3(W) R74.2
NetIC10_7: IC10.7(HOLD) R73.2
NetIC18_12: IC18.12(SCL) ; port FX3_I2C_SCL
NetIC18_13: IC18.13(SDA) ; port FX3_I2C_SDA
NetIC18_16: IC18.16(~{RST}) R132.2
NetIC19_1: IC19.1(S) J21.2 R126.2 R129.2
NetIC19_3: IC19.3(W) R131.2
NetIC19_7: IC19.7(HOLD) R130.2
NetJ21_1: J21.1 R126.1 ; port FX3_SPI_FLASH_SS
NetR69_2: R69.2 ; port FX3_SPI_AS_SS

Not connected (* = marked no-connect by the designer): IC18 3(O1)* 11(~{INT})*; JMP1 1 2

### Buses and harness runs
bus FPGA_AS_J[3..0] = port FPGA_AS_J[3..0]

### Notes on the sheet
- I2C Port Expander
- (near IC18) I2C addr: [1 1 0 1 1 0 1 RW]
- Switch for Flash selection of FPGA or FX3
- 0: FLASH conneccted to FX3 (NC to COM)
- IN:
- 1: FLASH conneccted to FPGA (NO to COM)
- I2C EEPROM
- I2C Address: [1 0 1 0 0 0 0 RW]
- (near R133) I2C addr: [1 0 0 1 0 0 0 RW]
- (near R133) I2C Temperature sensor
- (near R70) NF
- Optional FLASH (FPGA or FX3)
- PCB note: place between FPGA amd LMS
- Jumper    Boot from
- FX3 memory
- (near J21) 1-2        Flash
- (near J21) No        USB
- (near R126) NF
- Note:
- Project Name:
- Size:
- Date:
- Title:
- A3
- Revision:
- Time:
- Author:
- Sheet
- of
- File:
- (in symbol M25P40) SOIC-8

### Library data of the parts
C147 C148 C371-C373 C375 = Cap_0603: as C270 on sheet 12_USB3_0_device; Supplier 1: Mouser; Supplier Part Number 1: 81-GRM155R71C104KA88; Case Code - in: 0402; Manufacturer: Murata Electronics; Category: Multilayer Ceramic Capacitors MLCC - SMD/SMT; Voltage Rating DC: 16 V; Value: 100nF, 16V; Manufacturer Part Number: GRM155R71C104KA88D
IC9 = TS3A5018PWR: Manufacturer: TEXAS INSTRUMENTS; Part Description: IC SWITCH QUAD SPDT 16TSSOP; On State Resistance Max: 10; Analog Switch Case: TSSOP; Supply Voltage Range: 2.3V to 3.6; No. of Pins: 16; Analog Switch Type: SPDT; Supplier 1: Newark; Manufacturer Part Number 1: TS3A5018PW; Supplier Part Number 1: 71J8329
IC10 = M25P40: Manufacturer Part Number 1: M25P16-VMN6P; Manufacturer: Micron Technology Inc.; Part Description: IC FLASH 16MBIT 75MHZ 8SO; Supply Voltage Min: 2.7; Supply Voltage Max: 3.6; Memory Case Style: NSOIC; Memory Type: Flash; Memory Size: 16; Flash Memory Configuration: 2M x 8; No. of Pins: 8; Clock Frequency: 75; IC Interface Type: Serial, SPI; Page / Burst Read Access: 0.8; Supply Voltage Range: 2.7V to 3.6; Supplier 1: Farnell; Supplier Part Number 1: 1734973; RoHS: YES; Access Time: -; Operating Temperature Min: -40; Operating Temperature Max: 85; Packaging: Each; MSL: MSL 3 - 168 hours; Memory Voltage Vcc: 3.6; Operating Temperature Range: -40°C to +85
IC17 = LM75: Manufacturer: NXP Semiconductors; Manufacturer Part Number: LM75BTP,147; Part Description: SENSOR TEMPERATURE I2C 8HWSON; Sensing Temperature - Local: -55°C ~ 125°C; Output Type: I²C; Accuracy - Highest (Lowest): ±2°C (±3°C); Voltage - Supply: 2.8 V ~ 5.5 V; Test Condition: -25°C ~ 100°C (-55°C ~ 125°C); Sensor Type: Digital, Local; Resolution: 10 b; Supplier 1: Digi-Key; Operating Temperature: -55°C ~ 125°C; Features: Output Switch, Programmable Limit, Shutdown Mode; Supplier Device Package: 8-HWSON (2x3); Sensing Temperature - Remote: -; Category: Sensors, Transducers; Packaging: Tape & Reel (TR); RoHS: RoHS Compliant; Package / Case: 8-WFDFN Exposed Pad; Supplier Part Number 1: 568-9815-2-ND
IC18 = MAX7322ATE+: Manufacturer: Maxim Integrated; Part Description: IC I/O EXPANDER I2C 4B 16TQFN; Interface: I²C; Number of I/O: 4 (Input Only); Voltage - Supply: 1.7 V ~ 5.5 V; Interrupt Output: Yes; Current - Output Source/Sink: 20mA; Frequency - Clock: 400kHz; Supplier 1: Digi-Key; Mounting Type: Surface Mount; Category: Integrated Circuits (ICs); RoHS: RoHS Compliant; Packaging: Tube; Manufacturer Part Number: MAX7322ATE+; Supplier Device Package: 16-TQFN-EP (3x3); Package / Case: 16-WFQFN Exposed Pad; Operating Temperature: -40°C ~ 125°C; Features: POR; Output Type: -; Supplier Part Number 1: MAX7322ATE+-ND
IC19 = M25P40: Manufacturer: Micron Technology Inc; Part Description: IC FLASH 4MBIT 75MHZ 8SO; Manufacturer Part Number 1: M25P40-VMN6TPB; Memory Size: 4M (512K x 8); Voltage - Supply: 2.3 V ~ 3.6 V; Supplier 1: Digi-Key; Supplier Device Package: 8-SO; Supplier Part Number 1: M25P40-VMN6TPBTR-ND
IC39 = 24FC64F: Manufacturer Part Number 1: 24FC64F-I/ST; Manufacturer: Microchip Technology; Part Description: IC EEPROM 512KBIT 1MHZ 8TSSOP; Format - Memory: EEPROMs - Serial; Speed: 400kHz, 1MHz; Interface: I²C, 2-Wire Serial; Memory Type: EEPROM; Memory Size: 64K (8K x 8); Voltage - Supply: 1.7 V ~ 5.5 V; Supplier 1: Digi-Key; Packaging: Tube; Supplier Device Package: 8-TSSOP; Operating Temperature: -40°C ~ 85°C; RoHS: RoHS Compliant; Category: Integrated Circuits (ICs); Package / Case: 8-TSSOP (0.173", 4.40mm Width); Supplier Part Number 1: 24FC64F-I/ST-ND
J21 = Jumper: Manufacturer Part Number 1: GRPB021VWVN-RC; Manufacturer: Sullins Connector Solutions; Part Description: 2 Positions Header, Unshrouded Connector 0.050" (1.27mm) Through Hole Gold; Connector Type: Header, Unshrouded; Number of Positions: 2; Number of Positions Loaded: All; Pitch: 0.050" (1.27mm); Supplier 1: Digi-Key; Supplier Part Number 1: S9014E-02-ND; Contact Mating Length: 0.118" (3.00mm); Mounting Type: Through Hole; Termination: Solder; Fastening Type: -; Features: -; Contact Finish: Gold; Contact Finish Thickness: Flash; Color: -; Category: Connectors, Interconnects; RoHS: RoHS Compliant; Packaging: Bulk; Contact Type: Male Pin; Number of Rows: 1; Row Spacing: -
JMP1 = JUMP_2P_CONN_HEADER: Shorting Jumper, 2-position, 1.27mm pitch; Manufacturer Part Number 1: M50-2030005; Manufacturer: Harwin Inc.; Part Description: CONN SHUNT 1.27MM BLUE W/HANDLE; Gender: Female Sockets; Number of Positions or Pins (Grid): 2 (1 x 2); Pitch: 0.050" (1.27mm); Supplier 1: Digi-Key; Supplier Part Number 1: 952-1732-ND; Category: Connectors, Interconnects; RoHS: RoHS Compliant; Packaging: Bulk; Type: Closed Top, Grip; Height: 0.217" (5.50mm); Contact Finish: Gold; Contact Finish Thickness: 1µin (0.025µm); Color: Blue
R64 R69 R70 = Res_0402: as R92 on sheet 12_USB3_0_device; Supplier 1: Digi-Key; Supplier Part Number 1: 311-0.0JRTR-ND; Composition: Thick Film; Package / Case: 0402 (1005 Metric); Category: Resistors; Value: 0R
R66 R132 R133 = Res_0402: as R115-R117 on sheet 12_USB3_0_device; Value: 10k, 1%; Supplier 1: Digi-Key; Supplier Part Number 1: 311-10.0KLRTR-ND; Resistance (Ohms): 10k; Packaging: Tape & Reel (TR); RoHS: RoHS Compliant; Package / Case: 0402 (1005 Metric); Tolerance: ±1%; Operating Temperature: -55°C ~ 155°C; Size / Dimension: 0.039" L x 0.020" W (1.00mm x 0.50mm); Number of Terminations: 2; Category: Resistors; Height: 0.016" (0.40mm); Supplier Device Package: 0402; Features: Moisture Resistant; Composition: Thick Film
R68 = Res_0402: as R98 on sheet 12_USB3_0_device; Supplier 1: Digi-Key; Supplier Part Number 1: 311-22.0LRTR-ND; Supplier Device Package: 0402; Composition: Thick Film; Category: Resistors; Value: 22R
R71 R123 = Res_0402: as R118 on sheet 12_USB3_0_device; Supplier 1: Digi-Key; Supplier Part Number 1: P100KJCT-ND; Resistance (Ohms): 100k; Composition: Thick Film; Features: Automotive AEC-Q200; Number of Terminations: 2; Height: 0.016" (0.40mm); RoHS: RoHS Compliant; Package / Case: 0402 (1005 Metric); Packaging: Cut Tape (CT); Size / Dimension: 0.039" L x 0.020" W (1.00mm x 0.50mm); Supplier Device Package: 0402; Operating Temperature: -55°C ~ 155°C; Category: Resistors
  R71: value: 100K
  R123: Value: 100K
R72-R74 R129-R131 = Res_0402: Manufacturer Part Number 1: RMCF0402JT4K70; Part Description: RES SMD 4.7K OHM 5% 1/16W 0402; Manufacturer: Stackpole Electronics Inc.; Temperature Coefficient: ±100ppm/°C; Resistance(Ohms): 4.7k; Tolerance: ±5%; Supplier 1: Digi-Key; Composition: Thick Film; Supplier Device Package: 0402; Supplier: Digi-Key; Supplier Part Number 1: RMCF0402JT4K70TR-ND; Category: Resistors; Value: 4K7
R126 = Res_0402: as R124 on sheet 12_USB3_0_device; Value: 0R; Supplier 1: Digi-Key; Supplier Part Number 1: 311-0.0JRTR-ND; Category: Resistors; Temperature Coefficient: -; Features: Moisture Resistant; Supplier Device Package: 0402; Height: 0.016" (0.40mm); Package / Case: 0402 (1005 Metric); Operating Temperature: -55°C ~ 155°C; Size / Dimension: 0.039" L x 0.020" W (1.00mm x 0.50mm); Composition: Thick Film; Packaging: Tape & Reel (TR); Number of Terminations: 2; RoHS: RoHS Compliant